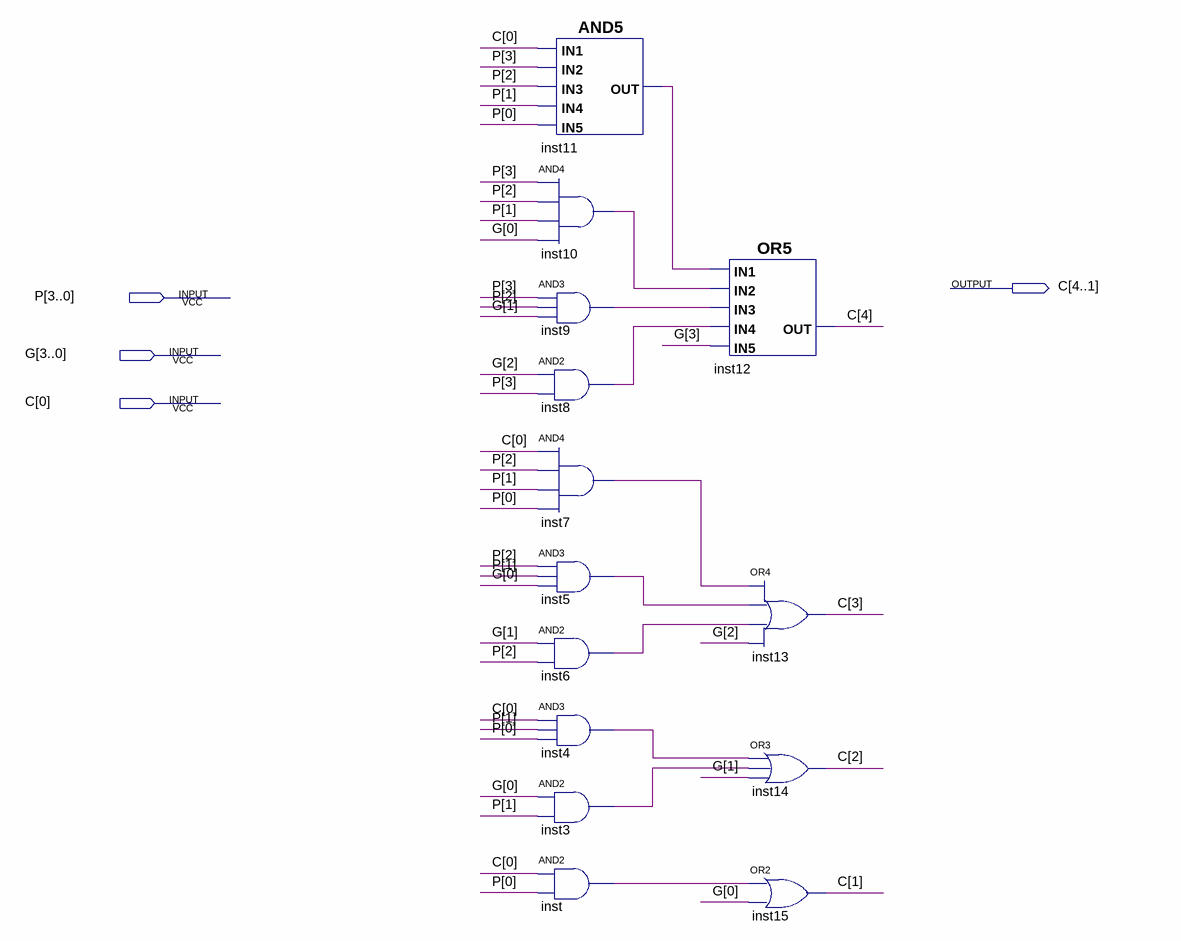
[diagram p0: schematic sheet]
// Quartus schematic CLA.bdf as structural Verilog: 14 symbols, 4 pins
module CLA (
  input  [3:0] P,
  input  [3:0] G,
  inout  [4:0] C
);

  wire inst3_out, inst4_out, inst5_out, inst6_out, inst7_out, inst8_out, inst9_out, inst10_out, inst11_out,
       inst_out;

  and inst11 (inst11_out, C[0], P[3], P[2], P[1], P[0]);
  and inst10 (inst10_out, P[3], P[2], P[1], G[0]);
  and inst9 (inst9_out, P[3], P[2], G[1]);
  and inst8 (inst8_out, G[2], P[3]);
  and inst7 (inst7_out, C[0], P[2], P[1], P[0]);
  and inst5 (inst5_out, P[2], P[1], G[0]);
  and inst6 (inst6_out, G[1], P[2]);
  and inst4 (inst4_out, C[0], P[1], P[0]);
  and inst3 (inst3_out, G[0], P[1]);
  and inst (inst_out, C[0], P[0]);
  or inst12 (C[4], inst11_out, inst10_out, inst9_out, inst8_out, G[3]);
  or inst13 (C[3], inst7_out, inst5_out, inst6_out, G[2]);
  or inst14 (C[2], inst4_out, inst3_out, G[1]);
  or inst15 (C[1], inst_out, G[0]);
endmodule
